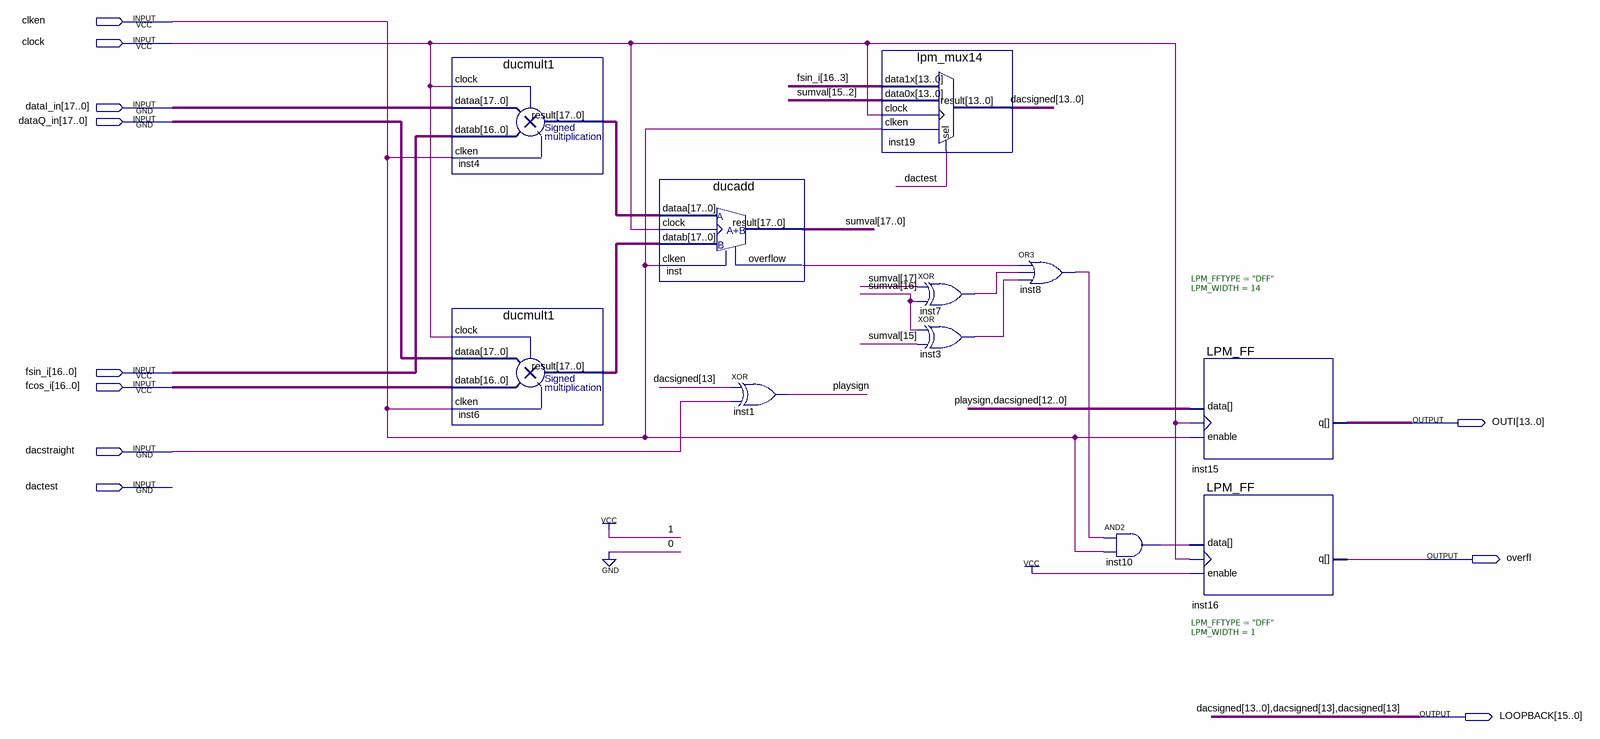
[diagram p0: schematic sheet]
// Quartus schematic duc_mux.bdf as structural Verilog: 11 symbols, 11 pins
module duc_mux (
  input  clken,
  input  clock,
  input  [17:0] dataI_in,
  input  [17:0] dataQ_in,
  input  [16:0] fsin_i,
  input  [16:0] fcos_i,
  input  dacstraight,
  input  dactest,
  output [13:0] OUTI,
  output overfl,
  output [15:0] LOOPBACK
);

  wire inst3_out, inst7_out, inst8_out, inst10_out, inst_overflow, playsign;
  wire [17:0] inst4_result, inst6_result, sumval;

  ducmult1 inst4 (.clock(clock), .dataa(dataI_in), .datab(fsin_i), .clken(clken), .result(inst4_result));
  ducmult1 inst6 (.clock(clock), .dataa(dataQ_in), .datab(fcos_i), .clken(clken), .result(inst6_result));
  ducadd inst (
    .dataa(inst4_result), .datab(inst6_result), .clken(clken), .clock(clock), .result(sumval),
    .overflow(inst_overflow));
  xor inst1 (playsign, LOOPBACK[15], dacstraight);
  lpm_mux14 inst19 (
    .data1x(fsin_i[16:3]), .data0x(sumval[15:2]), .clock(clock), .clken(clken), .sel(dactest),
    .result(LOOPBACK[15:2]));
  xor inst7 (inst7_out, sumval[17], sumval[16]);
  xor inst3 (inst3_out, sumval[16], sumval[15]);
  or inst8 (inst8_out, inst_overflow, inst7_out, inst3_out);
  and inst10 (inst10_out, inst8_out, clken);
  LPM_FF #(.LPM_FFTYPE("DFF"), .LPM_WIDTH(14)) inst15 (
    .clock(clock), .data({playsign, LOOPBACK[14:2]}), .enable(clken), .q(OUTI));
  LPM_FF #(.LPM_FFTYPE("DFF"), .LPM_WIDTH(1)) inst16 (.clock(clock), .data(inst10_out), .enable(1'b1), .q(overfl));

  assign LOOPBACK[1:0] = {2{LOOPBACK[15]}};

  // Other names for the same wires on the sheet: dacsigned[13:0] = LOOPBACK[15:2]
endmodule
